# Altium schematic sheet 03_MCU.SchDoc
size A3; Author: Ganghyeok Lim; Revision: B; SheetNumber: 4; SheetTotal: 7
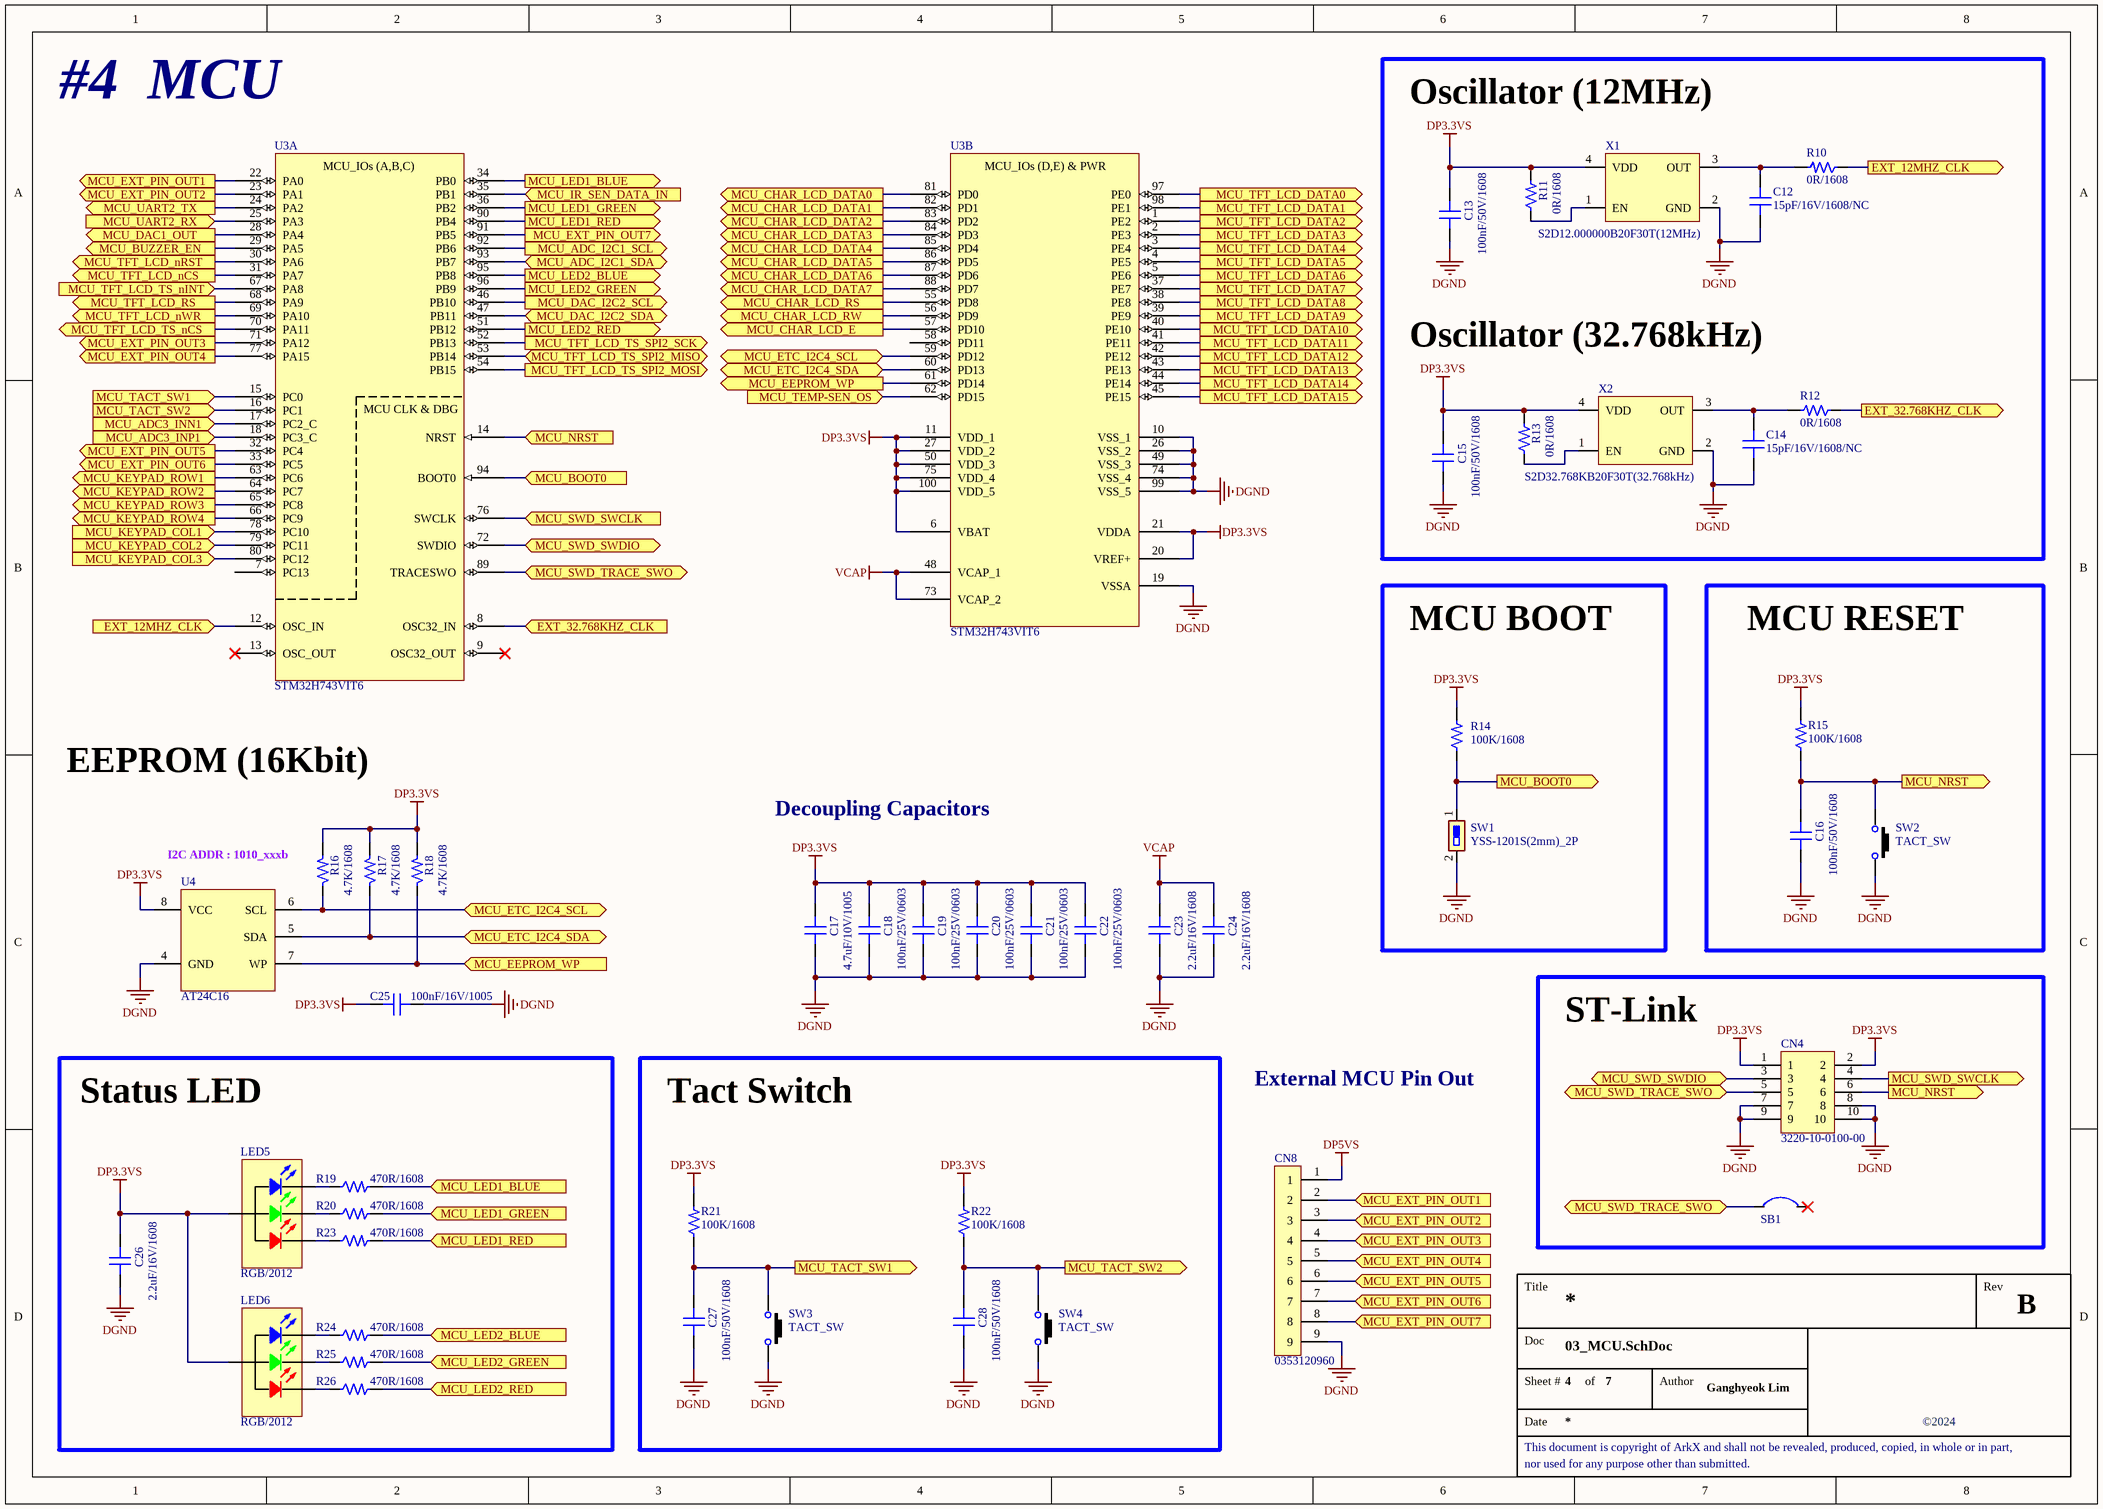
[diagram p0: 03_MCU.SchDoc]

## Parts
C12  15pF/16V/1608/NC  [CAP 1608 (0603_INCH)/NC]
C13  100nF/50V/1608  [CAP 1608 (0603_INCH)]
C14  15pF/16V/1608/NC  [CAP 1608 (0603_INCH)/NC]
C15  100nF/50V/1608  [CAP 1608 (0603_INCH)]
C16  100nF/50V/1608  [CAP 1608 (0603_INCH)]
C17  4.7uF/10V/1005  [CAP 1005 (0402_INCH)]
C18  100nF/25V/0603  [CAP 0603 (0201_INCH)]
C19  100nF/25V/0603  [CAP 0603 (0201_INCH)]
C20  100nF/25V/0603  [CAP 0603 (0201_INCH)]
C21  100nF/25V/0603  [CAP 0603 (0201_INCH)]
C22  100nF/25V/0603  [CAP 0603 (0201_INCH)]
C23  2.2uF/16V/1608  [CAP 1608 (0603_INCH)]
C24  2.2uF/16V/1608  [CAP 1608 (0603_INCH)]
C25  100nF/16V/1005  [CAP 1005 (0402_INCH)]
C26  2.2uF/16V/1608  [CAP 1608 (0603_INCH)]
C27  100nF/50V/1608  [CAP 1608 (0603_INCH)]
C28  100nF/50V/1608  [CAP 1608 (0603_INCH)]
CN4  3220-10-0100-00  [CON 3220-10-0100-00 (Hand_Solder)]
CN8  0353120960  [CON 0353120960 (MOLEX)]
LED5  RGB/2012  [LED MHT170RGBCT]
LED6  RGB/2012  [LED MHT170RGBCT]
R10  0R/1608  [RES 1608 (0603_inch)]
R11  0R/1608  [RES 1608 (0603_inch)]
R12  0R/1608  [RES 1608 (0603_inch)]
R13  0R/1608  [RES 1608 (0603_inch)]
R14  100K/1608  [RES 1608 (0603_inch)]
R15  100K/1608  [RES 1608 (0603_inch)]
R16  4.7K/1608  [RES 1608 (0603_inch)]
R17  4.7K/1608  [RES 1608 (0603_inch)]
R18  4.7K/1608  [RES 1608 (0603_inch)]
R19  470R/1608  [RES 1608 (0603_inch)]
R20  470R/1608  [RES 1608 (0603_inch)]
R21  100K/1608  [RES 1608 (0603_inch)]
R22  100K/1608  [RES 1608 (0603_inch)]
R23  470R/1608  [RES 1608 (0603_inch)]
R24  470R/1608  [RES 1608 (0603_inch)]
R25  470R/1608  [RES 1608 (0603_inch)]
R26  470R/1608  [RES 1608 (0603_inch)]
SB1  SB  [SB (Solder-Bridge)]  (value not drawn)
SW1  YSS-1201S(2mm)_2P  [SW YSS-1201S-2mm]
SW2  TACT_SW  [SW K2-1102SP-C4SC-04]
SW3  TACT_SW  [SW K2-1102SP-C4SC-04]
SW4  TACT_SW  [SW K2-1102SP-C4SC-04]
U3  STM32H743VIT6  [LQFP-100_14x14MM (ST)]  (parts A,B of 2)
U4  AT24C16  [TSSOP-8_PW (TI)]
X1  S2D12.000000B20F30T(12MHz)  [OSC SMD_2.5x2.0 (SCTF)]
X2  S2D32.768KB20F30T(32.768kHz)  [OSC SMD_2.5x2.0 (SCTF)]

## Blocks framed on the sheet
MCU BOOT: R14 SW1
MCU RESET: C16 R15 SW2
ST-Link: CN4 SB1
Status LED: C26 LED5 LED6 R19 R20 R23-R26
Tact Switch: C27 C28 R21 R22 SW3 SW4

## Ports
EXT_12MHZ_CLK (in), EXT_12MHZ_CLK (out), EXT_32.768KHZ_CLK (in), EXT_32.768KHZ_CLK (out), MCU_ADC3_INN1 (in), MCU_ADC3_INP1 (in), MCU_ADC_I2C1_SCL (out), MCU_ADC_I2C1_SDA (bidir), MCU_BOOT0 (in), MCU_BOOT0 (out), MCU_BUZZER_EN (out), MCU_CHAR_LCD_DATA0 (out), MCU_CHAR_LCD_DATA1 (out), MCU_CHAR_LCD_DATA2 (out), MCU_CHAR_LCD_DATA3 (out), MCU_CHAR_LCD_DATA4 (out), MCU_CHAR_LCD_DATA5 (out), MCU_CHAR_LCD_DATA6 (out), MCU_CHAR_LCD_DATA7 (out), MCU_CHAR_LCD_E (out), MCU_CHAR_LCD_RS (out), MCU_CHAR_LCD_RW (out), MCU_DAC1_OUT (out), MCU_DAC_I2C2_SCL (out), MCU_DAC_I2C2_SDA (bidir), MCU_EEPROM_WP (in), MCU_EEPROM_WP (out), MCU_ETC_I2C4_SCL (bidir), MCU_ETC_I2C4_SDA (bidir), MCU_EXT_PIN_OUT1 (in), MCU_EXT_PIN_OUT1 (out), MCU_EXT_PIN_OUT2 (in), MCU_EXT_PIN_OUT2 (out), MCU_EXT_PIN_OUT3 (in), MCU_EXT_PIN_OUT3 (out), MCU_EXT_PIN_OUT4 (in), MCU_EXT_PIN_OUT4 (out), MCU_EXT_PIN_OUT5 (in), MCU_EXT_PIN_OUT5 (out), MCU_EXT_PIN_OUT6 (in), MCU_EXT_PIN_OUT6 (out), MCU_EXT_PIN_OUT7 (in), MCU_EXT_PIN_OUT7 (out), MCU_IR_SEN_DATA_IN (in), MCU_KEYPAD_COL1 (in), MCU_KEYPAD_COL2 (in), MCU_KEYPAD_COL3 (in), MCU_KEYPAD_ROW1 (out), MCU_KEYPAD_ROW2 (out), MCU_KEYPAD_ROW3 (out), MCU_KEYPAD_ROW4 (out), MCU_LED1_BLUE (in), MCU_LED1_BLUE (out), MCU_LED1_GREEN (in), MCU_LED1_GREEN (out), MCU_LED1_RED (in), MCU_LED1_RED (out), MCU_LED2_BLUE (in), MCU_LED2_BLUE (out), MCU_LED2_GREEN (in), MCU_LED2_GREEN (out), MCU_LED2_RED (in), MCU_LED2_RED (out), MCU_NRST (in), MCU_NRST (out), MCU_SWD_SWCLK (in), MCU_SWD_SWCLK (out), MCU_SWD_SWDIO (bidir), MCU_SWD_TRACE_SWO (bidir), MCU_TACT_SW1 (in), MCU_TACT_SW1 (out), MCU_TACT_SW2 (in), MCU_TACT_SW2 (out), MCU_TEMP-SEN_OS (in), MCU_TFT_LCD_DATA0 (out), MCU_TFT_LCD_DATA1 (out), MCU_TFT_LCD_DATA2 (out), MCU_TFT_LCD_DATA3 (out), MCU_TFT_LCD_DATA4 (out), MCU_TFT_LCD_DATA5 (out), MCU_TFT_LCD_DATA6 (out), MCU_TFT_LCD_DATA7 (out), MCU_TFT_LCD_DATA8 (out), MCU_TFT_LCD_DATA9 (out), MCU_TFT_LCD_DATA10 (out), MCU_TFT_LCD_DATA11 (out), MCU_TFT_LCD_DATA12 (out), MCU_TFT_LCD_DATA13 (out), MCU_TFT_LCD_DATA14 (out), MCU_TFT_LCD_DATA15 (out), MCU_TFT_LCD_nCS (out), MCU_TFT_LCD_nRST (out), MCU_TFT_LCD_nWR (out), MCU_TFT_LCD_RS (out), MCU_TFT_LCD_TS_nCS (out), MCU_TFT_LCD_TS_nINT (in), MCU_TFT_LCD_TS_SPI2_MISO (bidir), MCU_TFT_LCD_TS_SPI2_MOSI (out), MCU_TFT_LCD_TS_SPI2_SCK (out), MCU_UART2_RX (in), MCU_UART2_TX (out)

## Nets
DGND: C12.1 C13.1 C14.1 C15.1 C16.1 C17.1 C18.1 C19.1 C20.1 C21.1 C22.1 C23.2 C24.2 C25.1 C26.2 C27.1 C28.1 CN4.7 CN4.8 CN4.9 CN4.10 CN8.9 SW1.2 SW2.1 SW3.1 SW4.1 U3.10(VSS_1) U3.19(VSSA) U3.26(VSS_2) U3.49(VSS_3) U3.74(VSS_4) U3.99(VSS_5) U4.4(GND) X1.2(GND) X2.2(GND)
DP3.3VS: C13.2 C15.2 C17.2 C18.2 C19.2 C20.2 C21.2 C22.2 C25.2 C26.1 CN4.1 CN4.2 LED5.4(Common_Anode) LED6.4(Common_Anode) R11.2 R13.2 R14.2 R15.2 R16.2 R17.2 R18.2 R21.2 R22.2 U3.6(VBAT) U3.11(VDD_1) U3.20(VREF+) U3.21(VDDA) U3.27(VDD_2) U3.50(VDD_3) U3.75(VDD_4) U3.100(VDD_5) U4.8(VCC) X1.4(VDD) X2.4(VDD)
DP5VS: CN8.1
VCAP: C23.1 C24.1 U3.48(VCAP_1) U3.73(VCAP_2)
EXT_12MHZ_CLK: R10.1 U3.12(OSC_IN) ; port EXT_12MHZ_CLK
EXT_32.768KHZ_CLK: R12.1 U3.8(OSC32_IN) ; port EXT_32.768KHZ_CLK
MCU_ADC3_INN1: U3.17(PC2_C) ; port MCU_ADC3_INN1
MCU_ADC3_INP1: U3.18(PC3_C) ; port MCU_ADC3_INP1
MCU_ADC_I2C1_SCL: U3.92(PB6) ; port MCU_ADC_I2C1_SCL
MCU_ADC_I2C1_SDA: U3.93(PB7) ; port MCU_ADC_I2C1_SDA
MCU_BOOT0: R14.1 SW1.1 U3.94(BOOT0) ; port MCU_BOOT0
MCU_BUZZER_EN: U3.29(PA5) ; port MCU_BUZZER_EN
MCU_CHAR_LCD_DATA0: U3.81(PD0) ; port MCU_CHAR_LCD_DATA0
MCU_CHAR_LCD_DATA1: U3.82(PD1) ; port MCU_CHAR_LCD_DATA1
MCU_CHAR_LCD_DATA2: U3.83(PD2) ; port MCU_CHAR_LCD_DATA2
MCU_CHAR_LCD_DATA3: U3.84(PD3) ; port MCU_CHAR_LCD_DATA3
MCU_CHAR_LCD_DATA4: U3.85(PD4) ; port MCU_CHAR_LCD_DATA4
MCU_CHAR_LCD_DATA5: U3.86(PD5) ; port MCU_CHAR_LCD_DATA5
MCU_CHAR_LCD_DATA6: U3.87(PD6) ; port MCU_CHAR_LCD_DATA6
MCU_CHAR_LCD_DATA7: U3.88(PD7) ; port MCU_CHAR_LCD_DATA7
MCU_CHAR_LCD_E: U3.57(PD10) ; port MCU_CHAR_LCD_E
MCU_CHAR_LCD_RS: U3.55(PD8) ; port MCU_CHAR_LCD_RS
MCU_CHAR_LCD_RW: U3.56(PD9) ; port MCU_CHAR_LCD_RW
MCU_DAC1_OUT: U3.28(PA4) ; port MCU_DAC1_OUT
MCU_DAC_I2C2_SCL: U3.46(PB10) ; port MCU_DAC_I2C2_SCL
MCU_DAC_I2C2_SDA: U3.47(PB11) ; port MCU_DAC_I2C2_SDA
MCU_EEPROM_WP: R18.1 U3.61(PD14) U4.7(WP) ; port MCU_EEPROM_WP
MCU_ETC_I2C4_SCL: R16.1 U3.59(PD12) U4.6(SCL) ; port MCU_ETC_I2C4_SCL
MCU_ETC_I2C4_SDA: R17.1 U3.60(PD13) U4.5(SDA) ; port MCU_ETC_I2C4_SDA
MCU_EXT_PIN_OUT1: CN8.2 U3.22(PA0) ; port MCU_EXT_PIN_OUT1
MCU_EXT_PIN_OUT2: CN8.3 U3.23(PA1) ; port MCU_EXT_PIN_OUT2
MCU_EXT_PIN_OUT3: CN8.4 U3.71(PA12) ; port MCU_EXT_PIN_OUT3
MCU_EXT_PIN_OUT4: CN8.5 U3.77(PA15) ; port MCU_EXT_PIN_OUT4
MCU_EXT_PIN_OUT5: CN8.6 U3.32(PC4) ; port MCU_EXT_PIN_OUT5
MCU_EXT_PIN_OUT6: CN8.7 U3.33(PC5) ; port MCU_EXT_PIN_OUT6
MCU_EXT_PIN_OUT7: CN8.8 U3.91(PB5) ; port MCU_EXT_PIN_OUT7
MCU_IR_SEN_DATA_IN: U3.35(PB1) ; port MCU_IR_SEN_DATA_IN
MCU_KEYPAD_COL1: U3.78(PC10) ; port MCU_KEYPAD_COL1
MCU_KEYPAD_COL2: U3.79(PC11) ; port MCU_KEYPAD_COL2
MCU_KEYPAD_COL3: U3.80(PC12) ; port MCU_KEYPAD_COL3
MCU_KEYPAD_ROW1: U3.63(PC6) ; port MCU_KEYPAD_ROW1
MCU_KEYPAD_ROW2: U3.64(PC7) ; port MCU_KEYPAD_ROW2
MCU_KEYPAD_ROW3: U3.65(PC8) ; port MCU_KEYPAD_ROW3
MCU_KEYPAD_ROW4: U3.66(PC9) ; port MCU_KEYPAD_ROW4
MCU_LED1_BLUE: R19.2 U3.34(PB0) ; port MCU_LED1_BLUE
MCU_LED1_GREEN: R20.2 U3.36(PB2) ; port MCU_LED1_GREEN
MCU_LED1_RED: R23.2 U3.90(PB4) ; port MCU_LED1_RED
MCU_LED2_BLUE: R24.2 U3.95(PB8) ; port MCU_LED2_BLUE
MCU_LED2_GREEN: R25.2 U3.96(PB9) ; port MCU_LED2_GREEN
MCU_LED2_RED: R26.2 U3.51(PB12) ; port MCU_LED2_RED
MCU_NRST: C16.2 CN4.6 R15.1 SW2.3 U3.14(NRST) ; port MCU_NRST
MCU_SWD_SWCLK: CN4.4 U3.76(SWCLK) ; port MCU_SWD_SWCLK
MCU_SWD_SWDIO: CN4.3 U3.72(SWDIO) ; port MCU_SWD_SWDIO
MCU_SWD_TRACE_SWO: CN4.5 SB1.1 U3.89(TRACESWO) ; port MCU_SWD_TRACE_SWO
MCU_TACT_SW1: C27.2 R21.1 SW3.3 U3.15(PC0) ; port MCU_TACT_SW1
MCU_TACT_SW2: C28.2 R22.1 SW4.3 U3.16(PC1) ; port MCU_TACT_SW2
MCU_TEMP-SEN_OS: U3.62(PD15) ; port MCU_TEMP-SEN_OS
MCU_TFT_LCD_DATA0: U3.97(PE0) ; port MCU_TFT_LCD_DATA0
MCU_TFT_LCD_DATA1: U3.98(PE1) ; port MCU_TFT_LCD_DATA1
MCU_TFT_LCD_DATA2: U3.1(PE2) ; port MCU_TFT_LCD_DATA2
MCU_TFT_LCD_DATA3: U3.2(PE3) ; port MCU_TFT_LCD_DATA3
MCU_TFT_LCD_DATA4: U3.3(PE4) ; port MCU_TFT_LCD_DATA4
MCU_TFT_LCD_DATA5: U3.4(PE5) ; port MCU_TFT_LCD_DATA5
MCU_TFT_LCD_DATA6: U3.5(PE6) ; port MCU_TFT_LCD_DATA6
MCU_TFT_LCD_DATA7: U3.37(PE7) ; port MCU_TFT_LCD_DATA7
MCU_TFT_LCD_DATA8: U3.38(PE8) ; port MCU_TFT_LCD_DATA8
MCU_TFT_LCD_DATA9: U3.39(PE9) ; port MCU_TFT_LCD_DATA9
MCU_TFT_LCD_DATA10: U3.40(PE10) ; port MCU_TFT_LCD_DATA10
MCU_TFT_LCD_DATA11: U3.41(PE11) ; port MCU_TFT_LCD_DATA11
MCU_TFT_LCD_DATA12: U3.42(PE12) ; port MCU_TFT_LCD_DATA12
MCU_TFT_LCD_DATA13: U3.43(PE13) ; port MCU_TFT_LCD_DATA13
MCU_TFT_LCD_DATA14: U3.44(PE14) ; port MCU_TFT_LCD_DATA14
MCU_TFT_LCD_DATA15: U3.45(PE15) ; port MCU_TFT_LCD_DATA15
MCU_TFT_LCD_nCS: U3.31(PA7) ; port MCU_TFT_LCD_nCS
MCU_TFT_LCD_nRST: U3.30(PA6) ; port MCU_TFT_LCD_nRST
MCU_TFT_LCD_nWR: U3.69(PA10) ; port MCU_TFT_LCD_nWR
MCU_TFT_LCD_RS: U3.68(PA9) ; port MCU_TFT_LCD_RS
MCU_TFT_LCD_TS_nCS: U3.70(PA11) ; port MCU_TFT_LCD_TS_nCS
MCU_TFT_LCD_TS_nINT: U3.67(PA8) ; port MCU_TFT_LCD_TS_nINT
MCU_TFT_LCD_TS_SPI2_MISO: U3.53(PB14) ; port MCU_TFT_LCD_TS_SPI2_MISO
MCU_TFT_LCD_TS_SPI2_MOSI: U3.54(PB15) ; port MCU_TFT_LCD_TS_SPI2_MOSI
MCU_TFT_LCD_TS_SPI2_SCK: U3.52(PB13) ; port MCU_TFT_LCD_TS_SPI2_SCK
MCU_UART2_RX: U3.25(PA3) ; port MCU_UART2_RX
MCU_UART2_TX: U3.24(PA2) ; port MCU_UART2_TX
NetC12_2: C12.2 R10.2 X1.3(OUT)
NetC14_2: C14.2 R12.2 X2.3(OUT)
NetLED5_1: LED5.1(RED) R23.1
NetLED5_2: LED5.2(GREEN) R20.1
NetLED5_3: LED5.3(BLUE) R19.1
NetLED6_1: LED6.1(RED) R26.1
NetLED6_2: LED6.2(GREEN) R25.1
NetLED6_3: LED6.3(BLUE) R24.1
NetR11_1: R11.1 X1.1(EN)
NetR13_1: R13.1 X2.1(EN)

Not connected (* = marked no-connect by the designer): SB1 2*; U3 7(PC13) 9(OSC32_OUT)* 13(OSC_OUT)* 58(PD11)

## Notes on the sheet
- #4  MCU
- Oscillator (12MHz)
- Oscillator (32.768kHz)
- EEPROM (16Kbit)
- I2C ADDR : 1010_xxxb
- Decoupling Capacitors
- External MCU Pin Out
- Title
- Rev
- Doc
- Sheet #
- of
- Author
- This document is copyright of ArkX and shall not be revealed, produced, copied, in whole or in part,
- Date
- ©2024
- nor used for any purpose other than submitted.
- (in symbol IC_MCU_STM32H743VIT6, part A) MCU_IOs (A,B,C); MCU CLK & DBG
- (in symbol IC_MCU_STM32H743VIT6, part B) MCU_IOs (D,E) & PWR

## Library data of the parts
C12 C14 = CAP_NC_15pF/16V/1608: Ceramic CAP_15pF/16V/1608
C13 C15 C16 C27 C28 = CAP_100nF/50V/1608: Ceramic CAP_100nF/50V/1608; LCSC Part #: C14663; JLCPCB Part Type: Basic Part
C17 = CAP_4.7uF/10V/1005: Ceramic CAP_4.7uF/10V/1005; LCSC Part #: C23733; JLCPCB Part Type: Basic Part
C18-C22 = CAP_100nF/25V/0603: Ceramic CAP_100nF/25V/0603; JLCPCB Part Type: Extended Part; LCSC Part #: C181047
C23 C24 C26 = CAP_2.2uF/16V/1608: Ceramic CAP_2.2uF/16V/1608; LCSC Part #: C23630; JLCPCB Part Type: Basic Part
C25 = CAP_100nF/16V/1005: Ceramic CAP_100nF/16V/1005; LCSC Part #: C1525; JLCPCB Part Type: Basic Part
CN4 = CON_IDC_3220-10-0100-00: CONN HEADER VERT 10POS 1.27MM
CN8 = CON_0353120960: CONN HEADER VERT 9POS 2.5MM
LED5 LED6 = LED_RGB_MHT170RGBCT: Colorless transparence -30℃~+85℃ Positive post Common anode RGB 120° 0805  Light Emitting Diodes (LED) ROHS; LCSC Part #: C2962094; JLCPCB Part Ype: Extended Part
R10-R13 = RES_0R/1608/0.1W: Value: 0R; Power Rating: 0.1W; Precision: 1%; Size: 1608; LCSC Part #: C21189; JLCPCB Part Type: Basic Part
R14 R15 R21 R22 = RES_100K/1608/0.1W: Value: 100K; Power Rating: 0.1W; Precision: 1%; Size: 1608; LCSC Part #: C25803; JLCPCB Part Type: Basic Part
R16-R18 = RES_4.7K/1608/0.1W: Value: 4.7K; Power Rating: 0.1W; Precision: 1%; Size: 1608; LCSC Part #: C23162; JLCPCB Part Type: Basic Part
R19 R20 R23-R26 = RES_470R/1608/0.1W: Value: 470R; Power Rating: 0.1W; Precision: 1%; Size: 1608; LCSC Part #: C23179; JLCPCB Part Type: Basic Part
SB1 = SB_Solder-Bridge
SW1 = SW_YSS-1201S(2mm)_2P: SMD Slide Switch. / Rating : DC 6V/0.3A / Travel : 2MM
SW2-SW4 = SW_K2-1102SP-C4SC-04(2P): -25℃~+85℃ 6mm 5mm Round Button 50mA Brick nogging 6mm SPST 100MΩ 100000 250gf@±30gf 12V SMD  Tactile Switches ROHS; LCSC Part #: C127509; JLCPCB Part Type: Extended Part
U3 = IC_MCU_STM32H743VIT6: MCU High-performance & DSP DP-FPU, Arm Cortex-M7 MCU 2MBytes of Flash 1MB RAM, 480 M; LCSC Part #: C114409; JLCPCB Part Type: Extended Part
U4 = IC_EEPROM_AT24C16: IC EEPROM 16KBIT I2C 1MHZ 8TSSOP; LCSC Part #: C112954; JLCPCB Part Type: Extended Part
X1 = OSC_S2D12.000000B20F30T(12MHz): 3.3V~3.3V -40℃~+85℃ 20mA ±20ppm 12MHz SMD2520-4P  Oscillators ROHS; LCSC Part #: C387449; JLCPCB Part Type: Extended Part
X2 = OSC_S2D32.768KB20F30T(32.768kHz): 3.3V ±20ppm CMOS 32.768kHz SMD2520-4P  Oscillators ROHS; LCSC Part #: C387463; JLCPCB Part Type: Extended Part